# Altium project RGB_CA_v1.0.PrjPcb
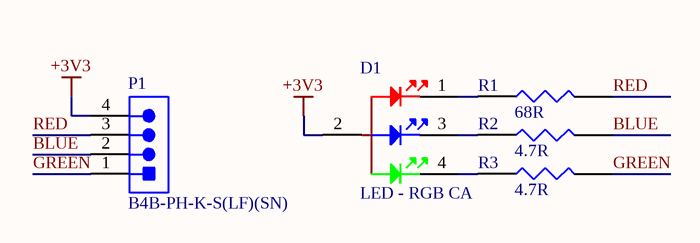
[diagram p0: RGB_CA_v1.0.SchDoc]
1 sheet, 5 parts. Net scope: global (net labels, ports and power ports of the same name join across sheets).
Board file: RGB_CA_v1.0.PcbDoc

## Sheet RGB_CA_v1.0.SchDoc
size A4

### Parts
D1  LED - RGB CA  [LED RGB CA 3528]
P1  B4B-PH-K-S(LF)(SN)  [JST-B4B-PH-K-S_V]
R1  68R  [68R 0603]
R2  4.7R  [4.7R 0603]
R3  4.7R  [4.7R 0603]

### Nets
+3V3: D1.2(Anode) P1.4
BLUE: P1.2 R2.2
GREEN: P1.1 R3.2
RED: P1.3 R1.2
NetD1_1: D1.1(Red) R1.1
NetD1_3: D1.3(Blue) R2.1
NetD1_4: D1.4(Green) R3.1

### Library data of the parts
D1 = CLV1A-FKB-CK1VW1DE1BB7C3C3: Multicolor LED Red/Green/Blue 624nm/535nm/475nm 50mA/25mA/25mA 4-Pin SMD T/R; Manufacturer: Cree; Color: Blue,Green,Red; Lens Style: Round,Flat; Element Configuration: Common Anode; Luminous Intensity: 310mcd; Forward Voltage: 3.2V; Test Current: 20mA; Dominant Wavelength: 468nm; Supplier 1: Digi-Key; Supplier Part Number 1: CLV1A-FKB-CK1VW1DE1BB7C3C3CT-ND; Manufacturer Part Number: CLV1A-FKB-CK1VW1DE1BB7C3C3; RoHS: No; Category: LEDs; Stock 1: 95758; Pricing 1: 1=0.42000, 10=0.39500, 100=0.36480, 1000=0.32631 (USD); Mount: Surface Mount; Case/Package: PLCC; Number of Pins: 4; Packaging: Cut Tape; Length: 3.2mm; Height: 2.1mm; Width: 2.8mm; ComponentLink1URL: http://www.farnell.com/datasheets/2606189.pdf?src-supplier=Farnell; ComponentLink1Description: http://www.farnell.com/datasheets/2606189.pdf?src-supplier=Farnell; ComponentLink2URL: https://www.cree.com/led-components/media/documents/ds-CLV1A-FKB.pdf?src-supplier=Digi-Key; ComponentLink2Description: https://www.cree.com/led-components/media/documents/ds-CLV1A-FKB.pdf?src-supplier=Digi-Key
P1 = CMP-2000-05165-1: Male Header, Pitch 2 mm, 1 x 4 Position, Height 6 mm, Tail Length 3.4 mm, -25 to 85 degC, RoHS, Bulk; Manufacturer: JST; No of Positions: 4; Style/Orientation: StraightHeader/Plug; Pitch: 2mm; Datasheet URL: http://datasheet.octopart.com/B4B-PH-K-S%28LF%29%28SN%29-JST-datasheet-10558886.pdf; Type: ShroudedHeader; Manufacturer URL: http://www.jst.com/home2.html; Termination: Crimp; Datasheet Version: Apr-09
R1 = CRGP0603F68R: CRGP 0603 68R 1%; Manufacturer: TE Connectivity; Max Power Dissipation: 250mW; Temperature Coefficient: 200ppm/°C; Supplier 1: Digi-Key; Supplier Part Number 1: A130402CT-ND; Manufacturer Part Number: CRGP0603F68R; RoHS: No; Category: Chip SMD Resistors; Stock 1: 49308; Pricing 1: 1=0.14000, 10=0.11400, 100=0.04470, 1000=0.01870, 2500=0.01714 (USD); Case/Package: 0603; Case Code (Imperial): 0603; Case Code (Metric): 1608; Min Operating Temperature: -55°C; Max Operating Temperature: 155°C; Resistor Type: Thick Film; Packaging: Tape and Reel; Resistance: 68R; Tolerance: 1%; Number of Terminations: 2; ComponentLink1URL: https://www.te.com/commerce/DocumentDelivery/DDEController?Action=srchrtrv&amp;DocNm=9-1773463-9&amp;DocType=DS&amp;DocLang=English&src-supplier=Digi-Key; ComponentLink1Description: https://www.te.com/commerce/DocumentDelivery/DDEController?Action=srchrtrv&amp;DocNm=9-1773463-9&amp;DocType=DS&amp;DocLang=English&src-supplier=Digi-Key
R2 R3 = CRGCQ0603J4R7: Manufacturer: TE Connectivity; Supplier 1: Digi-Key; Supplier Part Number 1: A130077CT-ND; Manufacturer Part Number: CRGCQ0603J4R7; RoHS: No; Category: Chip SMD Resistors; Stock 1: 47068; Pricing 1: 1=0.10000, 10=0.01900, 100=0.00780, 1000=0.00352, 2500=0.00306 (USD)